# EAGLE schematic V04 (EAGLE 7.1.0)
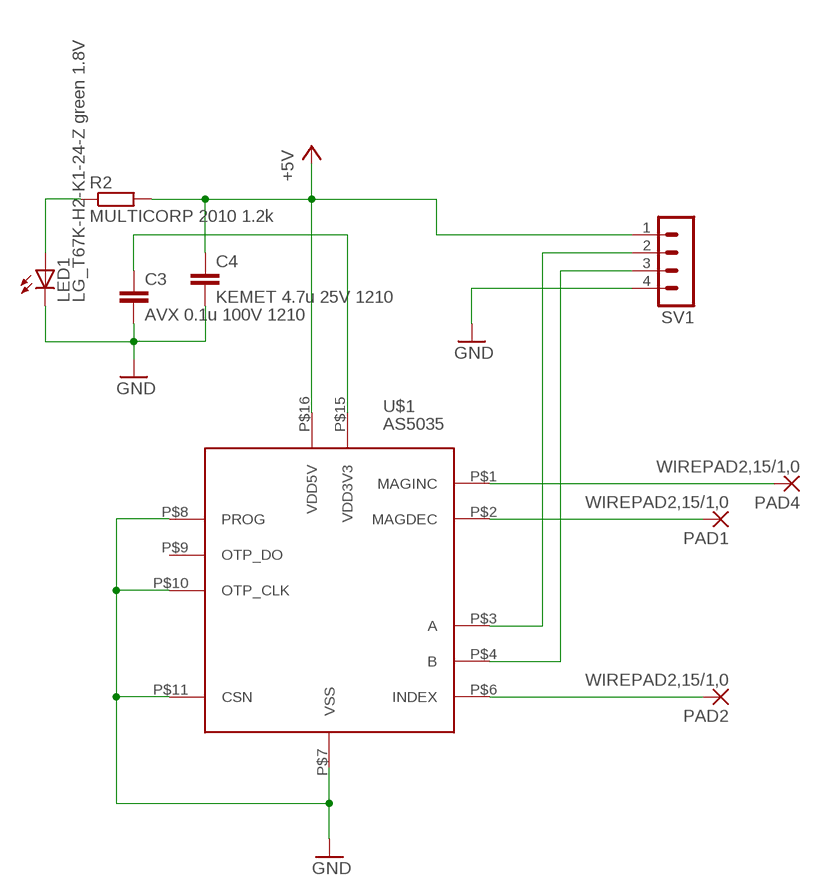
[diagram p0: schematic, sheet 1]

## Parts
C3  AVX 0.1u 100V 1210  C-EUC1210  [C1210]
C4  KEMET 4.7u 25V 1210  C-EUC1210  [C1210]
LED1  LG_T67K-H2-K1-24-Z green 1.8V  LG_T679-E1F1-1  [PLCC2]
PAD1  WIREPAD2,15/1,0  [2,15/1,0]
PAD2  WIREPAD2,15/1,0  [2,15/1,0]
PAD4  WIREPAD2,15/1,0  [2,15/1,0]
R2  MULTICORP 2010 1.2k  R-EU_R2010  [R2010]
SV1  MA04-1  [MA04-1]
U$1  AS5035  [TSSOP-16]

## Nets
+5V: C4.1 R2.2 SV1.1 U$1.P$16(VDD5V)
GND: C3.2 C4.2 LED1.C SV1.4 U$1.P$7(VSS) U$1.P$8(PROG) U$1.P$10(OTP_CLK) U$1.P$11(CSN)
N$1: C3.1 U$1.P$15(VDD3V3)
N$2: PAD1.1(P) U$1.P$2(MAGDEC)
N$3: PAD4.1(P) U$1.P$1(MAGINC)
N$4: PAD2.1(P) U$1.P$6(INDEX)
N$6: LED1.A R2.1
N$7: SV1.3 U$1.P$4(B)
N$8: SV1.2 U$1.P$3(A)
Unconnected: U$1.P$9(OTP_DO)

## Library data of the parts
C3 C4 = rcl:C-EU: CAPACITOR, European symbol
LED1 = led:*_T679-?-1: LC TOPLED® Low Current LED Source: http://catalog.osram-os.com .. LG_LS_LY_T679_OBS.pdf; COLOR: green
PAD1 PAD2 PAD4 = wirepad:WIREPAD: Wire PAD connect wire on PCB
R2 = rcl:R-EU_: RESISTOR, European symbol
SV1 = con-lstb:MA04-1: PIN HEADER; OC_FARNELL: unknown; OC_NEWARK: unknown
U$1 = keysie:AS5035